# Altium schematic sheet dc_p3_t11_Sch.SchDoc: A3 Template
size A4; Author: Duleepa J Thrimawithana; CompanyName: The University of Auckland; Organization: Department of ECSE; Address1: 20 Symonds Street; Address2: Auckland 101; Address3: New Zealand; Revision: 1R0; SheetNumber: 1; SheetTotal: 3
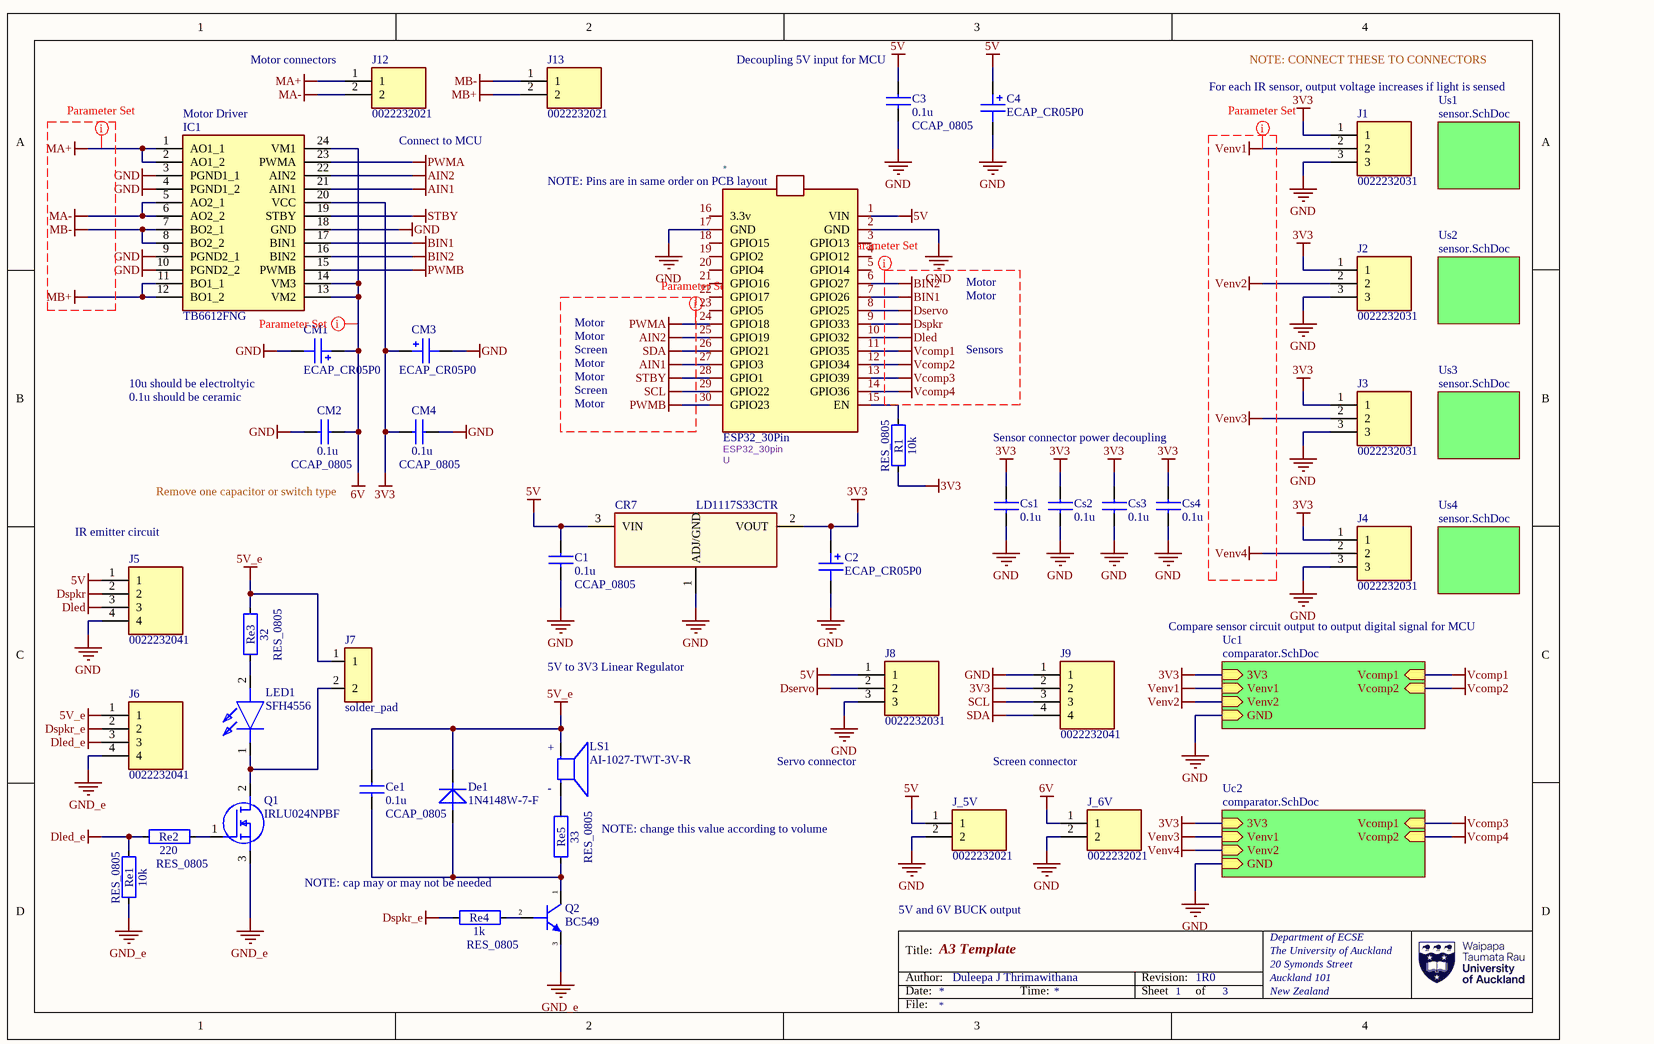
[diagram p0: dc_p3_t11_Sch.SchDoc]

## Parts
*  ESP32_30Pin  Reference: U  [ESP32_30pin]
C1  CCAP_0805  value 0.1u  [C0805]
C2  ECAP_CR05P0  [EC_CR05]
C3  CCAP_0805  value 0.1u  [C0805]
C4  ECAP_CR05P0  [EC_CR05]
Ce1  CCAP_0805  value 0.1u  [C0805]
CM1  ECAP_CR05P0  [EC_CR05]
CM2  CCAP_0805  value 0.1u  [C0805]
CM3  ECAP_CR05P0  [EC_CR05]
CM4  CCAP_0805  value 0.1u  [C0805]
CR7  LD1117S33CTR  [SOT-223_STM]
Cs1  value 0.1u  [C0805]  (hidden comment: CCAP_0805)
Cs2  value 0.1u  [C0805]  (hidden comment: CCAP_0805)
Cs3  value 0.1u  [C0805]  (hidden comment: CCAP_0805)
Cs4  value 0.1u  [C0805]  (hidden comment: CCAP_0805)
De1  1N4148W-7-F  [SOD123]
IC1  TB6612FNG  [SOP65P760X160-24N]
J1  0022232031  [HDRV3W87P0X254_1X3_747X635X1105P]
J2  0022232031  [HDRV3W87P0X254_1X3_747X635X1105P]
J3  0022232031  [HDRV3W87P0X254_1X3_747X635X1105P]
J4  0022232031  [HDRV3W87P0X254_1X3_747X635X1105P]
J5  0022232041  [SHDR4W87P0X254_1X4_1001X635X1105P]
J6  0022232041  [SHDR4W87P0X254_1X4_1001X635X1105P]
J7  solder_pad  [SOLDER_pad]
J8  0022232031  [HDRV3W87P0X254_1X3_747X635X1105P]
J9  0022232041  [SHDR4W87P0X254_1X4_1001X635X1105P]
J12  0022232021  [SHDR2W87P0X254_1X2_493X635X1105P]
J13  0022232021  [SHDR2W87P0X254_1X2_493X635X1105P]
J_5V  0022232021  [SHDR2W87P0X254_1X2_493X635X1105P]
J_6V  0022232021  [SHDR2W87P0X254_1X2_493X635X1105P]
LED1  SFH4556  [SFH4556]
LS1  AI-1027-TWT-3V-R  [XDCR_AI-1027-TWT-3V-R]
Q1  IRLU024NPBF  [IRLU024NPBF]
Q2  BC549  [TO92-BC549]
R1  RES_0805  value 10k  [R0805]
Re1  RES_0805  value 10k  [R0805]
Re2  RES_0805  value 220  [R0805]
Re3  RES_0805  value 32  [R0805]
Re4  RES_0805  value 1k  [R0805]
Re5  RES_0805  value 33  [R0805]

## Sub-sheets
Uc1 = comparator.SchDoc: 3V3 (in), Venv1 (in), Venv2 (in), GND (in), Vcomp1 (in), Vcomp2 (in)
Uc2 = comparator.SchDoc: 3V3 (in), Venv1 (in), Venv2 (in), GND (in), Vcomp1 (in), Vcomp2 (in)
Us1 = sensor.SchDoc: no entries
Us2 = sensor.SchDoc: no entries
Us3 = sensor.SchDoc: no entries
Us4 = sensor.SchDoc: no entries

## Nets
3V3: C2.1 CM3.1 CM4.2 CR7.2(VOUT) Cs1.1 Cs2.1 Cs3.1 Cs4.1 IC1.20(VCC) J1.1 J2.1 J3.1 J4.1 J9.2 R1.1 ; sheet Uc1/3V3, sheet Uc2/3V3
5V: *.1(VIN) C1.1 C3.1 C4.1 CR7.3(VIN) J5.1 J8.1 J_5V.1
5V_e: Ce1.1 De1.1(K) J6.1 J7.1 LS1.P Re3.2
6V: CM1.1 CM2.1 IC1.13(VM2) IC1.14(VM3) IC1.24(VM1) J_6V.1
AIN1: *.27(GPIO3) IC1.21(AIN1)
AIN2: *.25(GPIO19) IC1.22(AIN2)
BIN1: *.7(GPIO26) IC1.17(BIN1)
BIN2: *.6(GPIO27) IC1.16(BIN2)
Dled: *.10(GPIO32) J5.3
Dled_e: J6.3 Re1.2 Re2.1
Dservo: *.8(GPIO25) J8.2
Dspkr: *.9(GPIO33) J5.2
Dspkr_e: J6.2 Re4.1
GND: *.2(GND) *.17(GND) C1.2 C2.2 C3.2 C4.2 CM1.2 CM2.2 CM3.2 CM4.1 CR7.1(ADJ/GND) Cs1.2 Cs2.2 Cs3.2 Cs4.2 IC1.3(PGND1_1) IC1.4(PGND1_2) IC1.9(PGND2_1) IC1.10(PGND2_2) IC1.18(GND) J1.3 J2.3 J3.3 J4.3 J5.4 J8.3 J9.1 J_5V.2 J_6V.2 ; sheet Uc1/GND, sheet Uc2/GND
GND_e: J6.4 Q1.3(S) Q2.3(E) Re1.1
MA+: IC1.1(AO1_1) IC1.2(AO1_2) J12.1
MA-: IC1.5(AO2_1) IC1.6(AO2_2) J12.2
MB+: IC1.11(BO1_1) IC1.12(BO1_2) J13.2
MB-: IC1.7(BO2_1) IC1.8(BO2_2) J13.1
PWMA: *.24(GPIO18) IC1.23(PWMA)
PWMB: *.30(GPIO23) IC1.15(PWMB)
SCL: *.29(GPIO22) J9.3
SDA: *.26(GPIO21) J9.4
STBY: *.28(GPIO1) IC1.19(STBY)
Vcomp1: *.11(GPIO35) ; sheet Uc1/Vcomp1
Vcomp2: *.12(GPIO34) ; sheet Uc1/Vcomp2
Vcomp3: *.13(GPIO39) ; sheet Uc2/Vcomp1
Vcomp4: *.14(GPIO36) ; sheet Uc2/Vcomp2
Venv1: J1.2 ; sheet Uc1/Venv1
Venv2: J2.2 ; sheet Uc1/Venv2
Venv3: J3.2 ; sheet Uc2/Venv1
Venv4: J4.2 ; sheet Uc2/Venv2
Net*_15: *.15(EN) R1.2
NetCe1_2: Ce1.2 De1.2(A) Q2.1(C) Re5.1
NetJ7_2: J7.2 LED1.1(K) Q1.2(D)
NetLED1_2: LED1.2(A) Re3.1
NetLS1_N: LS1.N Re5.2
NetQ1_1: Q1.1(G) Re2.2
NetQ2_2: Q2.2(B) Re4.2

Not connected (* = marked no-connect by the designer): * 3(GPIO13) 4(GPIO12) 5(GPIO14) 16(3.3v) 18(GPIO15) 19(GPIO2) 20(GPIO4) 21(GPIO16) 22(GPIO17) 23(GPIO5)

## Layout directives
net class Signals: BIN2, PWMA, Venv1
net class Motor_Power: 6V, MA+

## Notes on the sheet
- (near IC1) Motor Driver
- (near J12) Motor connectors
- (near C3) Decoupling 5V input for MCU
- (near J1) For each IR sensor, output voltage increases if light is sensed
- NOTE: CONNECT THESE TO CONNECTORS
- Connect to MCU
- (near *) NOTE: Pins are in same order on PCB layout
- Motor
- 10u should be electroltyic
- Screen
- Sensors
- 0.1u should be ceramic
- Sensor connector power decoupling
- Remove one capacitor or switch type
- (near J5) IR emitter circuit
- Compare sensor circuit output to output digital signal for MCU
- 5V to 3V3 Linear Regulator
- Servo connector
- Screen connector
- NOTE: change this value according to volume
- NOTE: cap may or may not be needed
- 5V and 6V BUCK output
- Title:
- Author:
- Date:
- Time:
- Revision:
- Sheet
- of
- File:
- (in symbol AI-1027-TWT-3V-R) +; -

## Library data of the parts
C1 C3 Ce1 CM2 CM4 Cs1-Cs4 = CMP-00003-4: Generic 0805 cramic capacitor
C2 C4 CM1 CM3 = CMP-001-00002-5: Generic 5mm pitch TH radial electrolytic capacitor; Value: 10u
CR7 = LD1117S33CTR: Adjustable and fixed low drop positive voltage regulator; Manufacturer_Name: STMicroelectronics; Copyright: Copyright (C) 2026 Ultra Librarian. All rights reserved.; Manufacturer_Part_Number: LD1117S33CTR; RefDes: RefDes; Type: Type
De1 = CMP-004-00000-2: Small Signal Diode, Single, 100 V, 300 mA, 4ns, SOD-123; Current Rating: 150mA; Value: 2pF; Forward Voltage: 715mV
IC1 = TB6612FNG: Integrated Circuit; Manufacturer_Name: Toshiba; Datasheet Link: https://datasheet.datasheetarchive.com/originals/distributors/SFDatasheet-6/sf-000138015.pdf; Height: 1.6mm; Manufacturer_Part_Number: TB6612FNG; Mouser Part Number: N/A; Mouser Price/Stock: https://www.mouser.co.uk/ProductDetail/Toshiba/TB6612FNG?qs=By6Nw2ByBD2hYPrK9yTkWQ%3D%3D
J1-J4 J8 = 0022232031: Connector; Manufacturer_Name: Molex; Datasheet Link: https://www.molex.com/en-us/products/part-detail-pdf/22232031?display=pdf; Height: 11.05mm; Manufacturer_Part_Number: 0022232031; Mouser Part Number: N/A; Mouser Price/Stock: https://www.mouser.co.uk/ProductDetail/Molex/0022232031?qs=PBcRNPEHKsqLjUBIVcYwpw%3D%3D; Arrow Part Number: 0022232031; Arrow Price/Stock: https://www.arrow.com/en/products/0022232031/molex?utm_currency=USD&region=europe
J5 J6 J9 = 0022232041: Connector; Manufacturer_Name: Molex; Datasheet Link: https://www.molex.com/en-us/products/part-detail-pdf/22232041?display=pdf; Height: 11.05mm; Manufacturer_Part_Number: 0022232041; Mouser Part Number: N/A; Mouser Price/Stock: https://www.mouser.co.uk/ProductDetail/Molex/0022232041?qs=PBcRNPEHKsqk0H%252BHi3IwIw%3D%3D; Arrow Part Number: 0022232041; Arrow Price/Stock: https://www.arrow.com/en/products/0022232041/molex?region=europe
J12 J13 J_5V J_6V = 0022232021: Connector; Manufacturer_Name: Molex; Datasheet Link: https://www.molex.com/en-us/products/part-detail-pdf/22232021?display=pdf; Height: 11.05mm; Manufacturer_Part_Number: 0022232021; Mouser Part Number: N/A; Mouser Price/Stock: https://www.mouser.co.uk/ProductDetail/Molex/0022232021?qs=PBcRNPEHKspVhuxYRaP9bQ%3D%3D; Arrow Part Number: 0022232021; Arrow Price/Stock: https://www.arrow.com/en/products/0022232021/molex?utm_currency=USD&region=europe
LED1 = SFH4556: LED; Manufacturer_Name: ams OSRAM; Datasheet Link: https://look.ams-osram.com/m/23a378ed43eb7384/original/SFH-4556.pdf; Height: 8.1mm; Manufacturer_Part_Number: SFH4556
LS1 = AI-1027-TWT-3V-R: AUDIO INDICATOR 3VDC 30MA 80DBA 2700HZ; MF: PUI Audio; SnapEDA_Link: https://www.snapeda.com/parts/AI-1027-TWT-3V-R/PUI+Audio%252C+Inc./view-part/?ref=snap; Package: None; Value: *; MP: AI-1027-TWT-3V-R; Check_prices: https://www.snapeda.com/parts/AI-1027-TWT-3V-R/PUI+Audio%252C+Inc./view-part/?ref=eda
Q1 = IRLU024NPBF: MOSFET (N-Channel); Manufacturer_Name: Infineon; Datasheet Link: https://www.infineon.com/dgdl/irlr024npbf.pdf?fileId=5546d462533600a4015356694f7f265d; Height: 7.79mm; Manufacturer_Part_Number: IRLU024NPBF; Mouser Part Number: 942-IRLU024NPBF; Mouser Price/Stock: https://www.mouser.co.uk/ProductDetail/Infineon-Technologies/IRLU024NPBF?qs=9%252BKlkBgLFf2Ncy7i4oQSvA%3D%3D; Arrow Part Number: IRLU024NPBF; Arrow Price/Stock: https://www.arrow.com/en/products/irlu024npbf/infineon-technologies-ag?utm_currency=USD&region=europe
Q2 = CMP-00011-3: Small Signal Bipolar Transistor, 1A I(C), 80V V(BR)CEO, 1-Element, NPN, Silicon, TO-92; Manufacturer Lifecycle Status: ACTIVE; Transition Frequency: 300MHz; Max Collector Current: 100mA; Number of Elements: 1; hFE Min: 420; Collector Emitter Voltage (VCEO): 30V; REACH SVHC: Unknown; Introduction Date: 2009-12-03; RoHS: Compliant; Export Control Classification Number (ECCN) Code: EAR99; Number of Terminals: 3; Harmonized Tariff Schedule (HTS) Code: 85412100; Country of Origin: Mainland China; Lifecycle Status: Production; Max Operating Temperature: 150°C; Weight: 210mg
R1 Re1-Re5 = CMP-00002-12: Generic 0805 resistor; Voltage Rating: 150V; Package: 0805